# Altium schematic sheet Peripherals.SchDoc: Peripherals
size A; Author: Craig Hesling; DrawnBy: Craig Hesling; Revision: 2
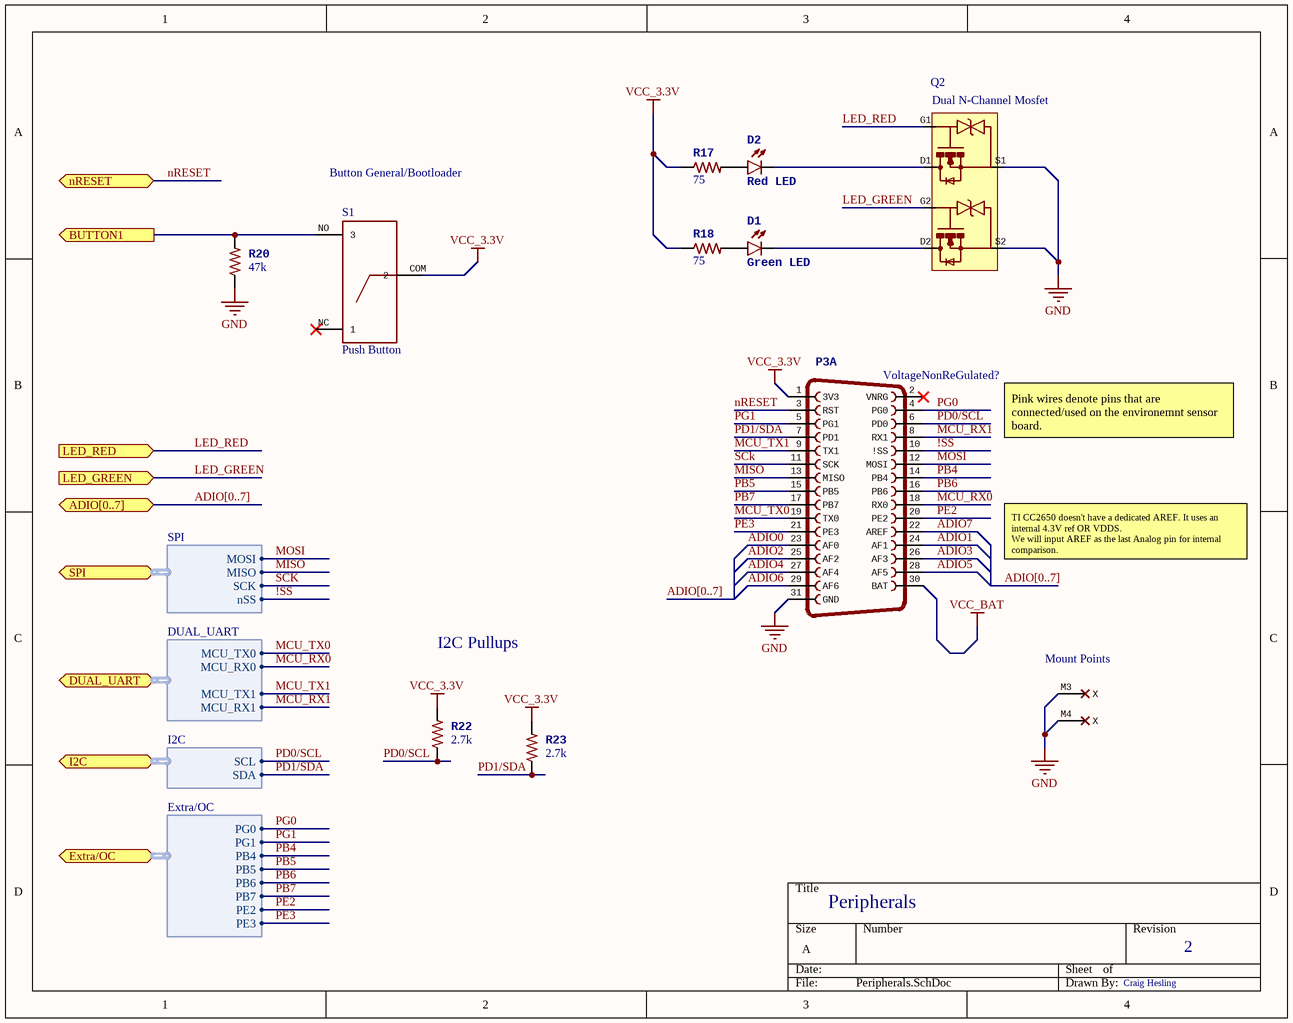
[diagram p0: Peripherals.SchDoc]

## Parts
D1  Green LED  [LED-0603]
D2  Red LED  [LED-0603]
P3  Addon Board for Firefly Sensor Nodes    This version is compliant with Firefly Micro powered by Atmel Atmega128RFA1.    Connectors on female gender match those on Firefly Micro Board.    Connectors on male gender mate with Firefly Micro Board. Use these for addons.  [FIREFLY_MICRO_BOARD]  (value not drawn)  (parts A,B,C of 3)
Q2  Dual N-Channel Mosfet  [FC6946010R (high-density)]
R17  value 75  [0603-RES]  (hidden comment: RES-00818)
R18  value 75  [0603-RES]  (hidden comment: RES-00818)
R20  value 47k  [0603-RES]  (hidden comment: RES-00824)
R22  value 2.7k  [0603-RES]  (hidden comment: RES-00824)
R23  value 2.7k  [0603-RES]  (hidden comment: RES-00824)
S1  Push Button  [Push_Button]

## Ports
ADIO[0..7] (bidir), BUTTON1 (out), DUAL_UART (harness DUAL_UART), Extra/OC (harness Extra/OC), I2C (harness I2C), LED_GREEN (in), LED_RED (in), nRESET (bidir), SPI (harness SPI)

## Harnesses
SPI: MOSI, MISO, SCK, nSS
DUAL_UART: MCU_TX0, MCU_RX0, MCU_TX1, MCU_RX1
I2C: SCL, SDA
Extra/OC: PG0, PG1, PB4, PB6, PB5, PB7, PE2, PE3

## Nets
GND: P3.31(GND) P3.M3(X) P3.M4(X) Q2.S1 Q2.S2 R20.1
VCC_3.3V: P3.1(3V3) R17.1 R18.1 R22.2 R23.2 S1.COM(2)
VCC_BAT: P3.30(BAT)
!SS: P3.10(!SS) ; port SPI.nSS
ADIO0: P3.23(AF0)
ADIO1: P3.24(AF1)
ADIO2: P3.25(AF2)
ADIO3: P3.26(AF3)
ADIO4: P3.27(AF4)
ADIO5: P3.28(AF5)
ADIO6: P3.29(AF6)
ADIO7: P3.22(AREF)
BUTTON1: R20.2 S1.NO(3) ; port BUTTON1
LED_GREEN: Q2.G2 ; port LED_GREEN
LED_RED: Q2.G1 ; port LED_RED
MCU_RX0: P3.18(RX0) ; port DUAL_UART.MCU_RX0
MCU_RX1: P3.8(RX1) ; port DUAL_UART.MCU_RX1
MCU_TX0: P3.19(TX0) ; port DUAL_UART.MCU_TX0
MCU_TX1: P3.9(TX1) ; port DUAL_UART.MCU_TX1
MISO: P3.13(MISO) ; port SPI.MISO
MOSI: P3.12(MOSI) ; port SPI.MOSI
nRESET: P3.3(RST) ; port nRESET
PB4: P3.14(PB4) ; port Extra/OC.PB4
PB5: P3.15(PB5) ; port Extra/OC.PB5
PB6: P3.16(PB6) ; port Extra/OC.PB6
PB7: P3.17(PB7) ; port Extra/OC.PB7
PD0/SCL: P3.6(PD0) R22.1 ; port I2C.SCL
PD1/SDA: P3.7(PD1) R23.1 ; port I2C.SDA
PE2: P3.20(PE2) ; port Extra/OC.PE2
PE3: P3.21(PE3) ; port Extra/OC.PE3
PG0: P3.4(PG0) ; port Extra/OC.PG0
PG1: P3.5(PG1) ; port Extra/OC.PG1
SCK: P3.11(SCK) ; port SPI.SCK
NetD1_A: D1.A R18.2
NetD1_C: D1.C Q2.D2
NetD2_A: D2.A R17.2
NetD2_C: D2.C Q2.D1

Not connected (* = marked no-connect by the designer): P3 2(VNRG)*; S1 NC(1)*

## Buses and harness runs
bus ADIO[0..7]
bus ADIO[0..7] = port ADIO[0..7]

## Notes on the sheet
- Button General/Bootloader
- (near P3) VoltageNonReGulated?
- Pink wires denote pins that are connected/used on the environemnt sensor board.
- TI CC2650 doesn't have a dedicated AREF. It uses an internal 4.3V ref OR VDDS.
  We will input AREF as the last Analog pin for internal comparison.
- I2C Pullups
- (near P3) Mount Points

## Library data of the parts
D1 = LED-GREEN0603: PROD_ID: DIO-00821
D2 = LED-RED0603: PROD_ID: DIO-00819
P3 = FIREFLY_MICRO_BOARD: GENDER: Female
Q2 = FC6946010R: Panasonic Dual N-Channel Moseft FC6946010R; Supplier 1: Newark; Supplier 2: Digi-Key; Supplier Part Number 1: 63W2173; Supplier Part Number 2: FC6946010RCT-ND
R17 R18 = 330OHM1/10W1%(0603): PROD_ID: RES-00818
R20 R22 R23 = 10KOHM-1/10W-1%(0603)0603: PROD_ID: RES-00824
S1 = CFPA: Supplier 1: Digi-Key; Supplier Part Number 1: 563-1246-2-ND